# EAGLE schematic Flight_Computer_V1 (EAGLE 9.6.2)
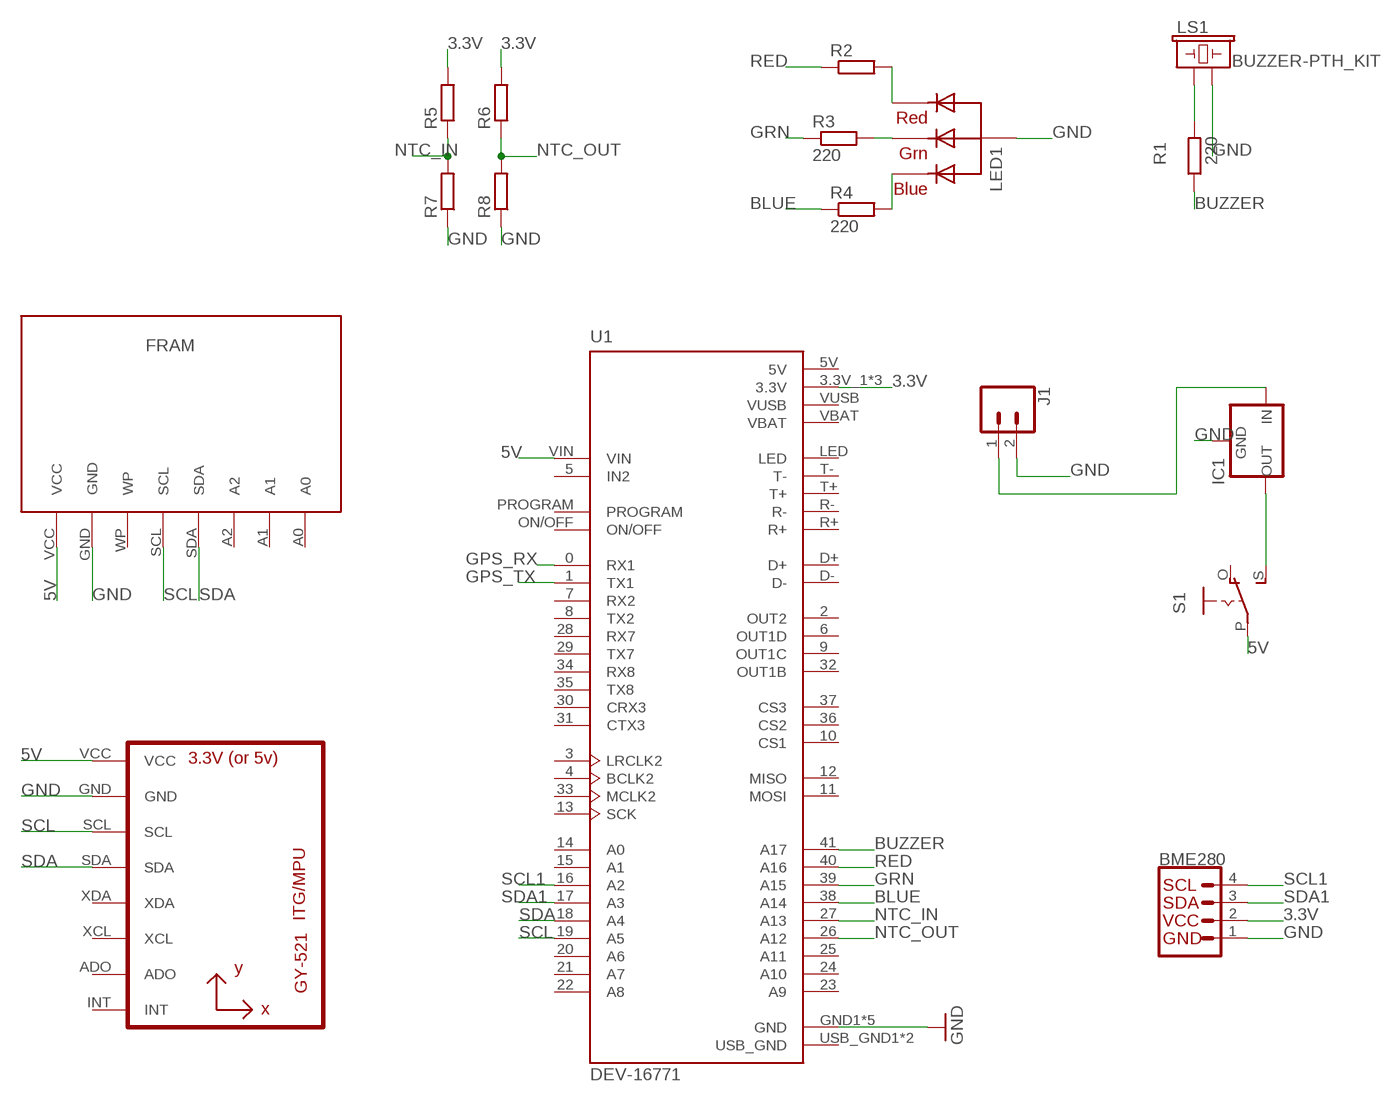
[diagram p0: schematic, sheet 1]

## Parts
BME280  I2C_STANDARD  [1X04]
FRAM  FRAM_I2C  [FRAM_I2C]
IC1  78XXS  [78XXS]
J1  CONN_023.5MM  [SCREWTERMINAL-3.5MM-2]
LED1  RGBLED_CA-5MM  [LED5MMRGB]
LS1  BUZZER-PTH_KIT  [BUZZER-12MM-KIT]
R1  220  R-EU_0204/7  [0204/7]
R2  R-EU_0204/7  [0204/7]
R3  220  R-EU_0204/7  [0204/7]
R4  220  R-EU_0204/7  [0204/7]
R5  R-EU_0204/7  [0204/7]
R6  R-EU_0204/7  [0204/7]
R7  R-EU_0204/7  [0204/7]
R8  R-EU_0204/7  [0204/7]
S1  EG1218S  [EG1218]
U1  DEV-16771  [MODULE_DEV-16771]
U2  GY-521MPU6050  [GY-521]

## Nets
3.3V: BME280.2 R5.2 R6.2 U1.3.3V_1(3.3V) U1.3.3V_2(3.3V) U1.3.3V_3(3.3V)
5V: FRAM.VCC S1.P U1.VIN U2.VCC
BLUE: R4.1 U1.38(A14)
BUZZER: R1.1 U1.41(A17)
GND: BME280.1 FRAM.GND IC1.GND J1.2 LED1.2(VCC) LS1.- R7.1 R8.1 U1.GND1(GND) U1.GND2(GND) U1.GND3(GND) U1.GND4(GND) U1.GND5(GND) U2.GND
GPS_RX: U1.0(RX1)
GPS_TX: U1.1(TX1)
GRN: R3.1 U1.39(A15)
N$1: LS1.+ R1.2
N$2: LED1.1(RED) R2.2
N$3: LED1.3(GREEN) R3.2
N$4: LED1.4(BLUE) R4.2
N$5: IC1.IN J1.1
N$6: IC1.OUT S1.S
NTC_IN: R5.1 R7.2 U1.27(A13)
NTC_OUT: R6.1 R8.2 U1.26(A12)
RED: R2.1 U1.40(A16)
SCL: FRAM.SCL U1.19(A5) U2.SCL
SCL1: BME280.4 U1.16(A2)
SDA: FRAM.SDA U1.18(A4) U2.SDA
SDA1: BME280.3 U1.17(A3)
Unconnected: FRAM.A0 FRAM.A1 FRAM.A2 FRAM.WP S1.O U1.2(OUT2) U1.3(LRCLK2) U1.4(BCLK2) U1.5(IN2) U1.6(OUT1D) U1.7(RX2) U1.8(TX2) U1.9(OUT1C) U1.10(CS1) U1.11(MOSI) U1.12(MISO) U1.13(SCK) U1.14(A0) U1.15(A1) U1.20(A6) U1.21(A7) U1.22(A8) U1.23(A9) U1.24(A10) U1.25(A11) U1.28(RX7) U1.29(TX7) U1.30(CRX3) U1.31(CTX3) U1.32(OUT1B) U1.33(MCLK2) U1.34(RX8) U1.35(TX8) U1.36(CS2) U1.37(CS3) U1.D+ U1.D- U1.LED U1.ON/OFF U1.PROGRAM U1.R+ U1.R- U1.T+ U1.T- U1.VBAT U1.VUSB U2.ADO U2.INT U2.XCL U2.XDA

## Power pins joined to a net without a drawn wire
5V: U1.5V
USB_GND: U1.USB_GND1(USB_GND) U1.USB_GND2(USB_GND)

## Library data of the parts
BME280 = SparkFun-Connectors:I2C_STANDARD: SparkFun I2C Standard Pinout Header SparkFun has standardized on a pinout for all I2C based sensor breakouts. This pinout allows I2C boards to be plugged directly into the headers on Arduino Uno compatible boards, and to be daisy chained easily. Example SparkFun Products: SparkFun Atmospheric Sensor Breakout - BME280 <https://www.sparkfun.com/products/13676> SparkFun Altitude/Pressure Sensor Breakout - MPL3115A2 <https://www.sparkfun.com/products/11084> SparkFun TOF Range Finder Sensor - VL6180 <https://www.sparkfun.com/products/12785>
FRAM = Adafruit_Modules:FRAM_I2C: Adafruit FRAM I2C Breakout 256kbit (32kbyte); ADAFRUIT: 1895
IC1 = v-reg:78XXS: VOLTAGE REGULATOR
J1 = SparkFun-Connectors:CONN_02: Multi connection point. Often used as Generic Header-pin footprint for 0.1 inch spaced/style header connections On any of the 0.1 inch spaced packages, you can populate with these: Break Away Headers - Straight <https://www.sparkfun.com/products/116> (PRT-00116) Break Away Male Headers - Right Angle <https://www.sparkfun.com/products/553> (PRT-00553) Female Headers <https://www.sparkfun.com/products/115> (PRT-00115) Break Away Headers - Machine Pin <https://www.sparkfun.com/products/117> (PRT-00117) Break Away Female Headers - Swiss Machine Pin <https://www.sparkfun.com/products/743> (PRT-00743) For SCREWTERMINALS and SPRING TERMINALS visit here: Screw Terimnals on SparkFun.com <https://www.sparkfun.com/search/results?term=Screw+Terminals> (5mm/3.5mm/2.54mm spacing) This device is also useful as a general connection point to wire up your design to another part of your project. Our various solder wires solder well into these plated through hole pads. Hook-Up Wire - Assortment (Stranded, 22 AWG) <https://www.sparkfun.com/products/11375> (PRT-11375) Hook-Up Wire - Assortment (Solid Core, 22 AWG) <https://www.sparkfun.com/products/11367> (PRT-11367) View the entire wire category on our website here <https://www.sparkfun.com/categories/141> Special notes: Molex polarized connector foot print use with: PRT-08233 with associated crimp pins and housings. 2.54_SCREWTERM for use with PRT-10571. 3.5mm Screw Terminal footprints for PRT-08084 5mm Screw Terminal footprints for use with PRT-08432; PROD_ID: CONN-08399
LED1 = adafruit:RGBLED_CA: RGB LED, common-anode 5MM Staggered pins 5mm Piranha package http://www.ladyada.net/library/pcb/eaglelibrary.html
LS1 = SparkFun-Electromechanical:BUZZER: Buzzer Small round buzzers that operate around the audible 2kHz range. You can use these as speakers to create simple music or user interfaces. Variant Overview: PTH - Mini Speaker - PC Mount 12mm 2.048kHz <https://www.sparkfun.com/products/7950> PTH_KIT - Mini Speaker - PC Mount 12mm 2.048kHz <https://www.sparkfun.com/products/7950> KIT simplifies soldering by adding stop mask to one side of the pads. PTH_NO_SILK - Mini Speaker - PC Mount 12mm 2.048kHz <https://www.sparkfun.com/products/7950> No silkscreen indicator of buzzer outline. PTH_KIT_NO_SILK - Mini Speaker - PC Mount 12mm 2.048kHz <https://www.sparkfun.com/products/7950> KIT package w/o silkscreen SMD - Buzzer Audio Magnetic (CCV-084B16) SMD buzzer used on, e.g. the LilyPad Buzzer <https://www.sparkfun.com/products/8463> and RFID USB Reader <https://www.sparkfun.com/products/9963>. SMD_KIT - Buzzer Audio Magnetic (CCV-084B16) SMD Buzzer with elongated pins to make soldering easier. Used on the SparkFun Simon Says - Surface Mount Soldering Kit <https://www.sparkfun.com/products/10935>. SMD-SQUARE - Buzzer Audio Magnetic (COMP-15701) SMT square buzzer with one chamfered corner.; PROD_ID: COMP-08253; SF_SKU: COM-07950
R1-R8 = rcl:R-EU_: RESISTOR, European symbol; SPICEPREFIX: R
S1 = adafruit:EG1218: SLIDING SWITCH 0.1" spacing through hole, vertical SPDT slide switch http://www.ladyada.net/library/pcb/eaglelibrary.html
U1 = DEV-16771:DEV-16771: RT1062 Teensy 4.1 i.MX ARM Cortex-M7 MPU Embedded Evaluation Board Check prices <https://pricing.snapeda.com/parts/DEV-16771/SparkFun%20Electronics/view-part?ref=eda>; AVAILABILITY: In Stock; DESCRIPTION: RT1062 Teensy 4.1 series ARM® Cortex®-M7 MPU Embedded Evaluation Board; MF: SparkFun Electronics; MP: DEV-16771; PACKAGE: None; PRICE: None; PURCHASE-URL: https://pricing.snapeda.com/search/part/DEV-16771/?ref=eda
U2 = gy-521:GY-521